# Altium schematic sheet Sensors.SchDoc
size A; SheetNumber: 3
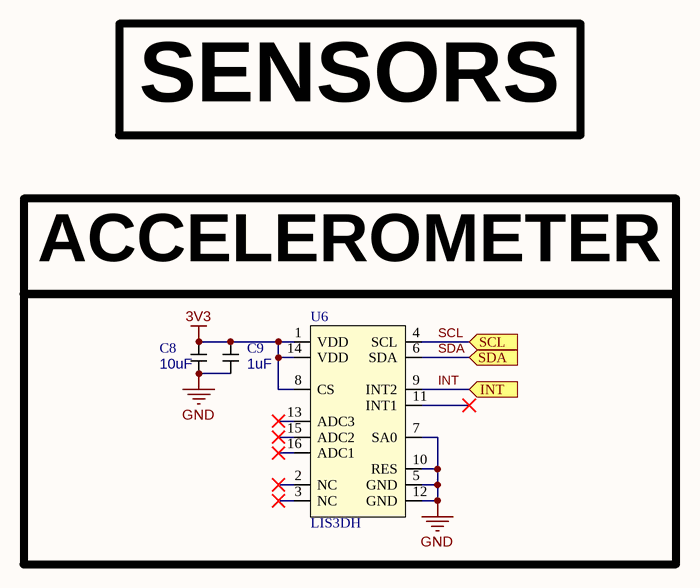
[diagram p0: Sensors.SchDoc]

## Parts
C8  10uF  [CAP_0402_HIGH]
C9  1uF  [CAP_0402_HIGH]
U6  LIS3DH  [LIS3DH]

## Ports
INT, SCL, SDA

## Nets
3V3: C8.2 C9.2 U6.1(VDD) U6.8(CS) U6.14(VDD)
GND: C8.1 C9.1 U6.5(GND) U6.7(SA0) U6.10(RES) U6.12(GND)
INT: U6.9(INT2) ; port INT
SCL: U6.4(SCL) ; port SCL
SDA: U6.6(SDA) ; port SDA

Not connected (* = marked no-connect by the designer): U6 2(NC)* 3(NC)* 11(INT1)* 13(ADC3)* 15(ADC2)* 16(ADC1)*

## Notes on the sheet
- SENSORS
- ACCELEROMETER

## Library data of the parts
C8 C9 = Capacitor_0402: 0402 Capacitor
U6 = LIS3DH: LIS3DH ACCEL 2-16G I2C/SPI 16LGA